# Altium schematic sheet Ethernet.SchDoc
size A4
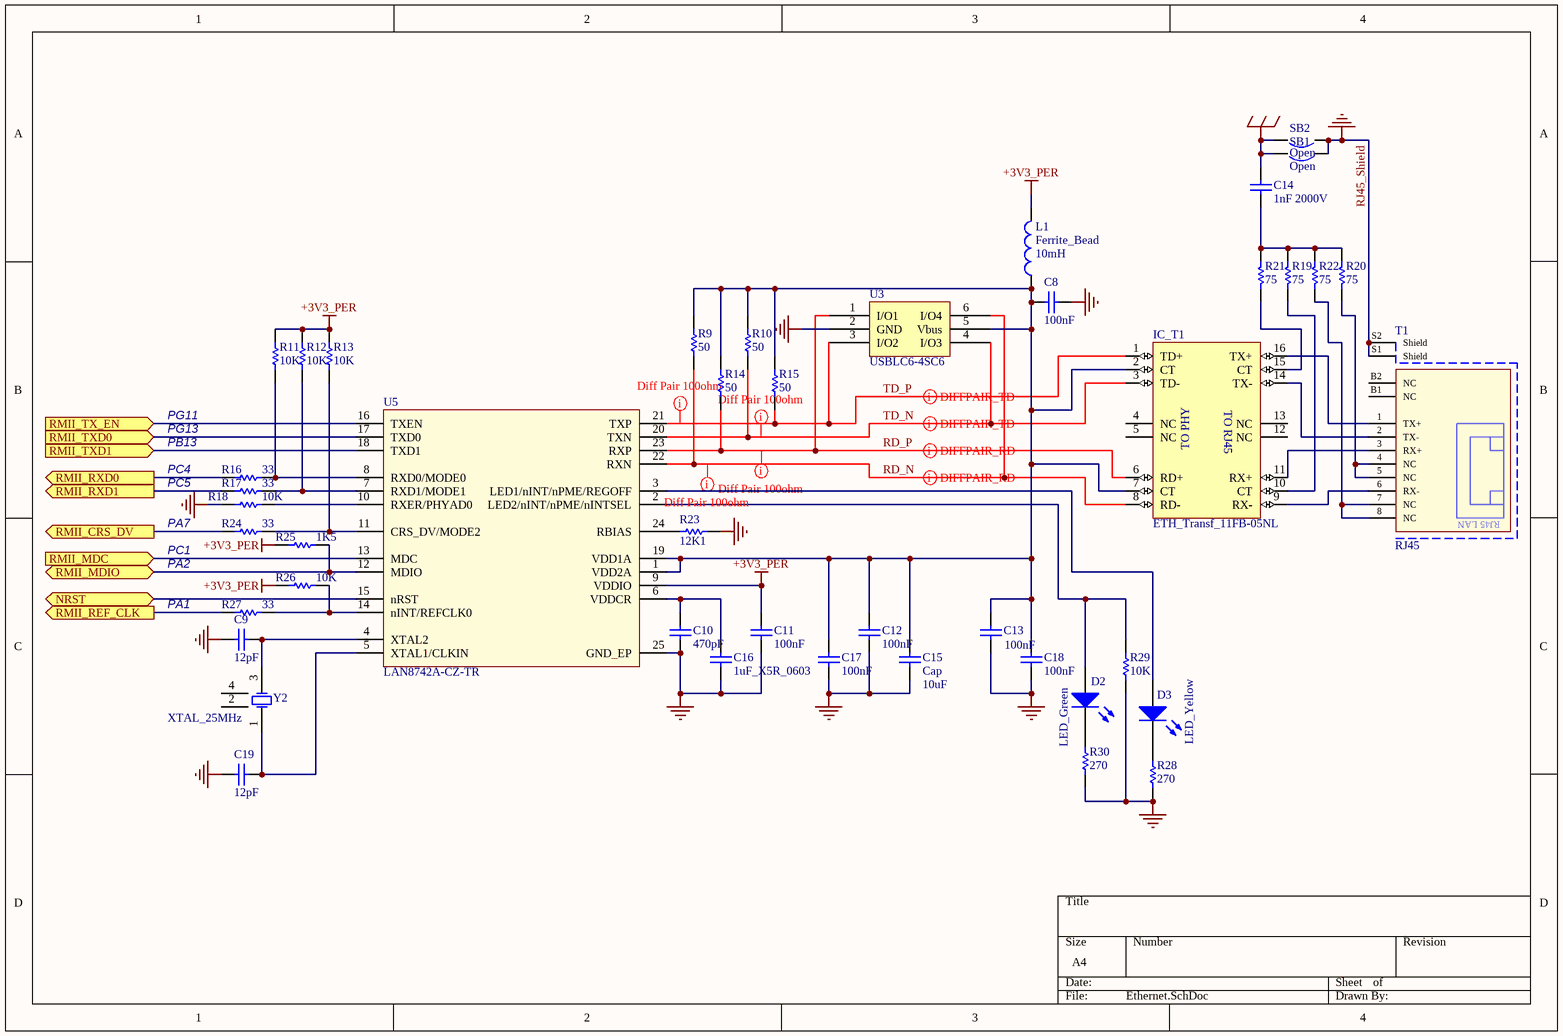
[diagram p0: Ethernet.SchDoc]

## Parts
C8  100nF  [C0603]
C9  12pF  [C0603]
C10  470pF  [C0603]
C11  100nF  [C0603]
C12  100nF  [C0603]
C13  100nF  [C0603]
C14  1nF 2000V  [C1206]
C15  Cap  value 10uF  [C0805]
C16  1uF_X5R_0603  [C0603]
C17  100nF  [C0603]
C18  100nF  [C0603]
C19  12pF  [C0603]
D2  LED_Green  [0603_LED]
D3  LED_Yellow  [0603_LED]
IC_T1  ETH_Transf_11FB-05NL  [ETH_Transf 11FB-05NL]
L1  Ferrite_Bead  value 10mH  [0805]
R9  50  [R0603]
R10  50  [R0603]
R11  10K  [R0603]
R12  10K  [R0603]
R13  10K  [R0603]
R14  50  [R0603]
R15  50  [R0603]
R16  33  [R0603]
R17  33  [R0603]
R18  10K  [R0603]
R19  75  [R0603]
R20  75  [R0603]
R21  75  [R0603]
R22  75  [R0603]
R23  12K1  [R0805]
R24  33  [R0603]
R25  1K5  [R0603]
R26  10K  [R0603]
R27  33  [R0603]
R28  270  [R0603]
R29  10K  [R0603]
R30  270  [R0603]
SB1  Open  [SB_0603]
SB2  Open  [SB_0603]
T1  RJ45  [RJ45_ETH]
U3  USBLC6-4SC6  [SOT23-6L]
U5  LAN8742A-CZ-TR  [QFN24_0R5_4X4]
Y2  XTAL_25MHz  [SMD-3225_4P]

## Ports
NRST, RMII_CRS_DV (out), RMII_MDC (in), RMII_MDIO (bidir), RMII_REF_CLK (out), RMII_RXD0 (out), RMII_RXD1 (out), RMII_TX_EN (in), RMII_TXD0 (in), RMII_TXD1 (in)

## Nets
+3V3_PER: C11.2 L1.2 R11.1 R12.1 R13.1 R25.2 R26.1 U5.9(VDDIO)
EGND: C14.1 SB1.1 SB2.1
RJ45_Shield: C8.1 C9.2 C10.1 C11.1 C12.1 C13.1 C15.1 C16.2 C17.1 C18.1 C19.2 R18.2 R23.2 R28.2 R29.2 R30.2 SB1.2 SB2.2 T1.S1(Shield) T1.S2(Shield) U3.2(GND) U5.25(GND_EP)  [also labelled GND]
NRST: U5.15(nRST) ; port NRST
RD_N: IC_T1.8(RD-) R9.1 U3.6(I/O4) U5.22(RXN)
RD_P: IC_T1.6(RD+) R14.1 U3.1(I/O1) U5.23(RXP)
RMII_CRS_DV: R24.2 ; port RMII_CRS_DV
RMII_MDC: U5.13(MDC) ; port RMII_MDC
RMII_MDIO: R25.1 U5.12(MDIO) ; port RMII_MDIO
RMII_REF_CLK: R27.2 ; port RMII_REF_CLK
RMII_RXD0: R16.2 ; port RMII_RXD0
RMII_RXD1: R17.2 ; port RMII_RXD1
RMII_TX_EN: U5.16(TXEN) ; port RMII_TX_EN
RMII_TXD0: U5.17(TXD0) ; port RMII_TXD0
RMII_TXD1: U5.18(TXD1) ; port RMII_TXD1
TD_N: IC_T1.3(TD-) R10.1 U3.4(I/O3) U5.20(TXN)
TD_P: IC_T1.1(TD+) R15.1 U3.3(I/O2) U5.21(TXP)
NetC8_2: C8.2 C12.2 C13.2 C15.2 C17.2 C18.2 IC_T1.2(CT) IC_T1.7(CT) L1.1 R9.2 R10.2 R14.2 R15.2 U3.5(Vbus) U5.1(VDD2A) U5.19(VDD1A)
NetC9_1: C9.1 U5.4(XTAL2) Y2.3(OSC2)
NetC10_2: C10.2 C16.1 U5.6(VDDCR)
NetC14_2: C14.2 R19.1 R20.1 R21.1 R22.1
NetC19_1: C19.1 U5.5(XTAL1/CLKIN) Y2.1(OSC1)
NetD2_1: D2.1(K) R30.1
NetD2_2: D2.2(A) R29.1 U5.2(LED2/nINT/nPME/nINTSEL)
NetD3_1: D3.1(K) R28.1
NetD3_2: D3.2(A) U5.3(LED1/nINT/nPME/REGOFF)
NetIC_T1_9: IC_T1.9(RX-) T1.6(RX-)
NetIC_T1_10: IC_T1.10(CT) R19.2
NetIC_T1_11: IC_T1.11(RX+) T1.3(RX+)
NetIC_T1_14: IC_T1.14(TX-) T1.2(TX-)
NetIC_T1_15: IC_T1.15(CT) R21.2
NetIC_T1_16: IC_T1.16(TX+) T1.1(TX+)
NetR11_2: R11.2 R16.1 U5.8(RXD0/MODE0)
NetR12_2: R12.2 R17.1 U5.7(RXD1/MODE1)
NetR13_2: R13.2 R24.1 U5.11(CRS_DV/MODE2)
NetR18_1: R18.1 U5.10(RXER/PHYAD0)
NetR20_2: R20.2 T1.4(NC) T1.5(NC)
NetR22_2: R22.2 T1.7(NC) T1.8(NC)
NetR23_1: R23.1 U5.24(RBIAS)
NetR26_2: R26.2 R27.1 U5.14(nINT/REFCLK0)

Not connected (* = marked no-connect by the designer): IC_T1 4(NC) 5(NC) 12(NC) 13(NC); T1 B1(NC) B2(NC); Y2 2(OSC1) 4(OSC1)

## Layout directives
differential pair: RD_N, RD_P, TD_N, TD_P
rule Matched Net Lengths [Tolerance = 100mil]: RD_N, RD_P, TD_N, TD_P

## Notes on the sheet
- PG11
- PG13
- PB13
- PC4
- PC5
- PA7
- PC1
- PA2
- PA1
- (in symbol ETH_Transf_11FB-05NL) TO RJ45; TO PHY
- (in symbol RJ45) RJ45 LAN

## Library data of the parts
C8 C11-C13 C17 C18 = Capacitor_ST: Capacitor 0402 / 0603 / 0805; Revision: July-2002: Re-released for DXP Platform.; Value: 100nF
C9 C10 C19 = Capacitor_ST: Capacitor 0402 / 0603 / 0805; Value: 100nF; Revision: July-2002: Re-released for DXP Platform.
C14 = Capacitor_ST: Capacitor 0402 / 0603 / 0805/ 1206; Value: 100nF; Revision: July-2002: Re-released for DXP Platform.
C15 = Cap: Capacitor; Published: 8-Jun-2000; LatestRevisionDate: 17-Jul-2002; LatestRevisionNote: Re-released for DXP Platform.; PackageReference: RAD-0.3; Publisher: Altium Limited; PackageDescription: Radial Cap, Thru-Hole; 2 Leads; 0.3 in Pin Spacing
C16 = CAP SMD 0603  X5R 1µF 25V 10%: 0603  X5R 1µF; Rated voltage: 25V; Tolerance: 10%; Manufacturer: *; Manufacturer P/N: *; Order code Farnell: 1288202RL; Value: 1µF; Power: *; Technology: X5R; Temperature  Factor: *; Temperature Max: +125°C; Temperature Min: -55°C; STS Code: *
D2 D3 = LED: SMD LED; PCB_Layout: Complies with manufacturer's recommendation.; Published: 14-Mar-2008; DatasheetVersion: Mar-2007; PackageVersion: Mar-2007; PackageReference: LWP4SG; Publisher: Altium Limited; PackageDescription: White LED; 2 Reverse Gullwing Leads, Body 1.9 x 0.875mm (Dia.xH); ComponentLink1Description: Manufacturer Link; ComponentLink1URL: http://www.osram-os.com/; ComponentLink2Description: Datasheet; ComponentLink2URL: http://catalog.osram-os.com/catalogue/catalogue.do;jsessionid=AD571800CED0208623E7FAFDF556DB1C?act=downloadFile&favOid=020000030001e106000200b6
L1 = Ferrite_Bead: Code_IEC: 1005; Published: 8-Jun-2000; LatestRevisionDate: 29-May-2009; LatestRevisionNote: IPC-7351 Footprint Added.; PackageReference: 0402-A; Publisher: Altium Limited; PackageDescription: Chip Inductor; Code_JEITA: 0402
R9 R10 R14 R15 = Res_50_1%_0603: Resistor,50,0603,1%,YAGEO; Manuf_Part_1: RC0402FR-0750RL; Value: 50; Manuf_1: YAGEO; Order: *; ECCN_US/EU: n/a; Distrib: FARNELL
R11-R13 R18 R26 R29 = Resistor_ST: Resistor 0402 / 0603 / 0805; Value: 10K
R16 R17 R24 R27 = Res_33_1%_0402: Resistor,33,0402,1%,YAGEO; Manuf_Part_1: RC0402FR-0733RL; Value: 33; Manuf_1: YAGEO; Order: *; ECCN_US/EU: n/a; Distrib: FARNELL
R19-R22 = Res_75_1%_0603: Resistor,75,0603,1%,YAGEO; Manuf_Part_1: RC0402FR-0750RL; Value: 50; Manuf_1: YAGEO; Order: *; ECCN_US/EU: n/a; Distrib: FARNELL
R23 = Res_12K1_1%_0603: Resistor,12K1,0603,1%,VISHAY; Manuf_Part_1: MCT 0603-50 1% P5 12K1; Order: 2325243; Value: 12K1; ECCN_US/EU: n/a; Manuf_1: VISHAY; Distrib: FARNELL
R25 = Res_1K5_1%_0402: Resistor,1K5,0402,1%,YAGEO; Manuf_Part_1: RC0402FR-071K5L; Value: 1K5; Manuf_1: YAGEO; Order: RC0402FR-071K5L; ECCN_US/EU: n/a; Distrib: FARNELL
R28 R30 = Resistor_ST: Resistor 0402 / 0603 / 0805; Value: 10K
SB1 SB2 = Circuit Breaker: Published: 24-Mar-1999; Revision: July-2002: Re-released for DXP Platform.; Publisher: Altium Limited
T1 = RJ45: WE-RJ45 LAN Transformer, 10/100 Base-T, THT, Port 1x1, Tab Up; Part Number: 7499010003A; PoE: non-PoE; LED (Left-Right): –; USB: No; ComponentLink1Description: Manufacturer; ComponentLink1URL: http://www.we-online.de; ComponentLink2Description: Datasheet; ComponentLink2URL: http://katalog.we-online.de/pbs/datasheet/7499010003A.pdf; Published Date: Dec. 2017; Publisher: Wurth Elektronik; Tab Position: Up; Port Number: 1x1; Data Rate: 10/100 Base-T; Operating Temperature: -40 to +85 degC; Mounting Technology: THT
U5 = LAN8742A-CZ-TR: LAN8742A-CZ-TR - Small Footprint RMII 10/100 Ethernet, Transceiver with HP Auto-MDIX and flexPWR Technology SQFN-24; Manuf_1: MICROCHIP; Order: LAN8742A-CZ-TR; Manuf_Part_1: LAN8742A-CZ-TR; Distrib: MICROCHIP
Y2 = XTAL_SMD: Crystal; Published: 8-Jun-2000; LatestRevisionDate: 17-Jul-2002; LatestRevisionNote: Re-released for DXP Platform.; PackageReference: R38; Publisher: Altium Limited; PackageDescription: Crystal, Thru-Hole; 2 Leads; Body 3.1 x 8.2 mm (Dia.xH)